# Altium schematic sheet gasbagCtrl_SingleChannel.SchDoc
size A4
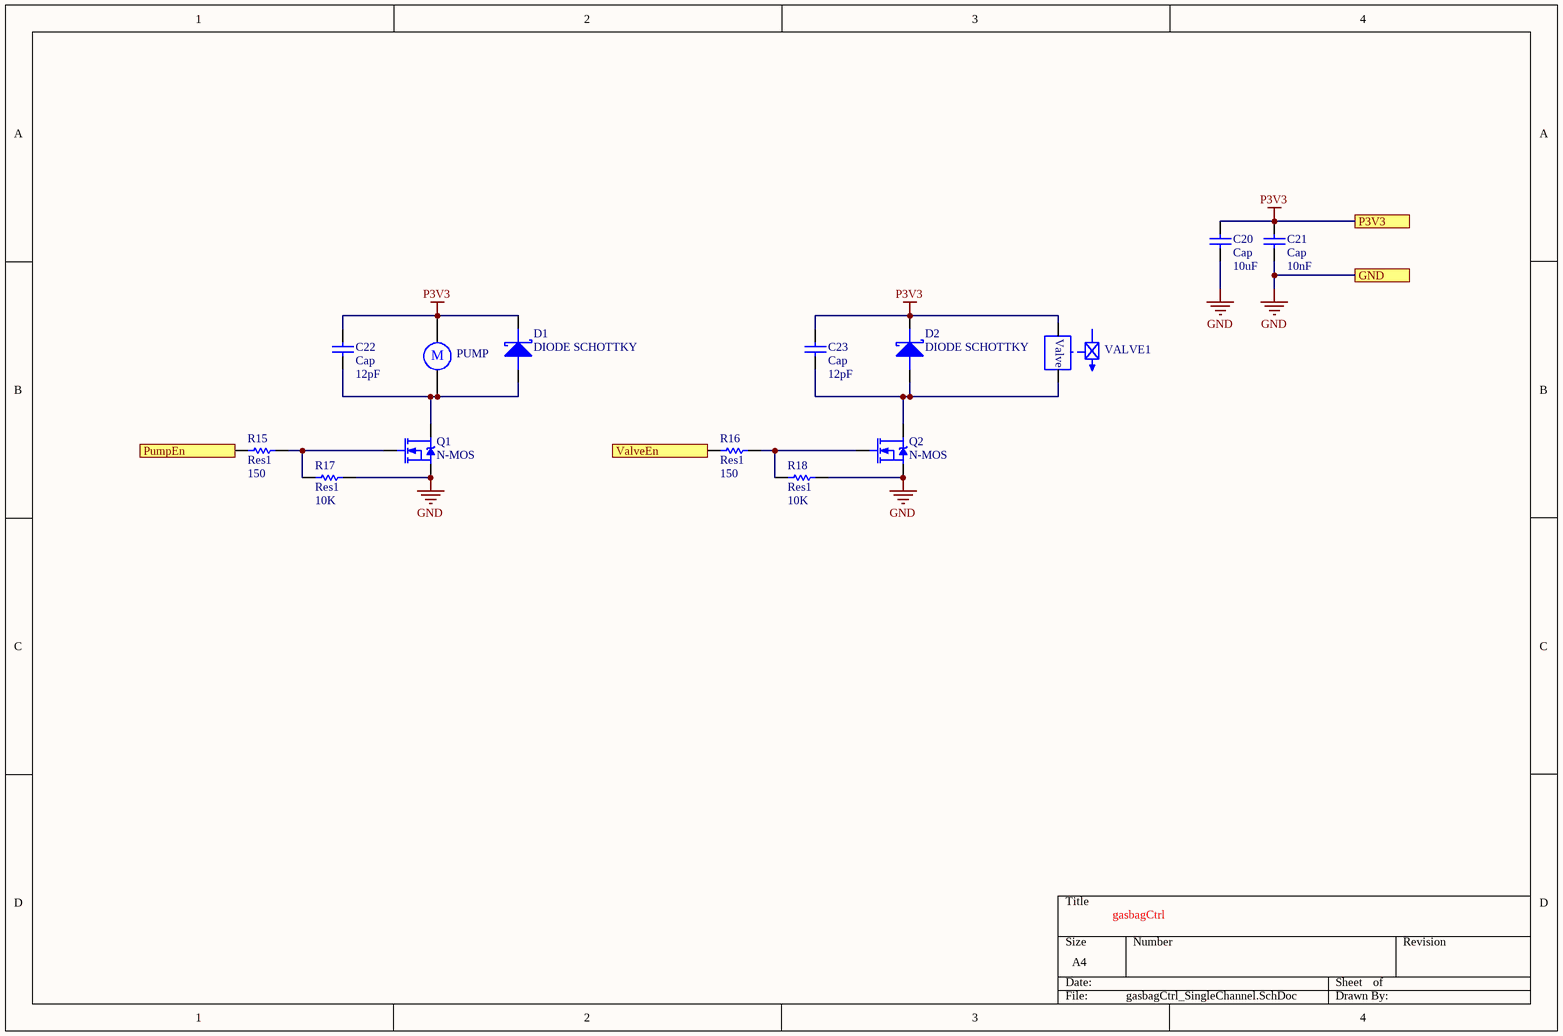
[diagram p0: gasbagCtrl_SingleChannel.SchDoc]

## Parts
B1  PUMP  [BAT-2]
C20  Cap  value 10uF  [0603C]
C21  Cap  value 10nF  [0603C]
C22  Cap  value 12pF  [0603C]
C23  Cap  value 12pF  [0603C]
D1  DIODE SCHOTTKY  [DO-15]
D2  DIODE SCHOTTKY  [DO-15]
Q1  N-MOS  [TO220A]
Q2  N-MOS  [TO220A]
R15  Res1  value 150  [0603R]
R16  Res1  value 150  [0603R]
R17  Res1  value 10K  [0603R]
R18  Res1  value 10K  [0603R]
VALVE1  Valve_1  [jack2.54]  (value not drawn)

## Ports
GND, P3V3, PumpEn (in), ValveEn (in)

## Nets
GND: C20.1 C21.1 Q1.S Q2.S R17.1 R18.1 ; port GND
P3V3: B1.1 C20.2 C21.2 C22.2 C23.2 D1.K D2.K VALVE1.2 ; port P3V3
PumpEn: R15.2 ; port PumpEn
ValveEn: R16.2 ; port ValveEn
NetB1_2: B1.2 C22.1 D1.A Q1.D
NetC23_1: C23.1 D2.A Q2.D VALVE1.1
NetQ1_G: Q1.G R15.1 R17.2
NetQ2_G: Q2.G R16.1 R18.2

## Notes on the sheet
- gasbagCtrl
- (in symbol Motor) M
- (in symbol Valve_1) Valve

## Library data of the parts
B1 = Motor: Motor, General Kind; Published: 24-Mar-1999; LatestRevisionDate: 17-Jul-2002; LatestRevisionNote: Re-released for DXP Platform.; PackageReference: RB5-10.5; Publisher: Altium Limited
C20-C23 = Cap: Capacitor; Published: 8-Jun-2000; LatestRevisionDate: 17-Jul-2002; LatestRevisionNote: Re-released for DXP Platform.; PackageReference: RAD-0.3; Publisher: Altium Limited; PackageDescription: Radial Cap, Thru-Hole; 2 Leads; 0.3 in Pin Spacing
D1 D2 = DIODE SCHOTTKY: 肖特基二极管
Q1 Q2 = N-MOS: N沟道场效应管
R15-R18 = Res1: Resistor; Published: 8-Jun-2000; LatestRevisionDate: 17-Jul-2002; LatestRevisionNote: Re-released for DXP Platform.; PackageReference: AXIAL-0.3; Publisher: Altium Limited; PackageDescription: Axial Device, Thru-Hole; 2 Leads; 0.3 in Pin Spacing